# EAGLE design BMS ERROR Detection (EAGLE 8.4.1)
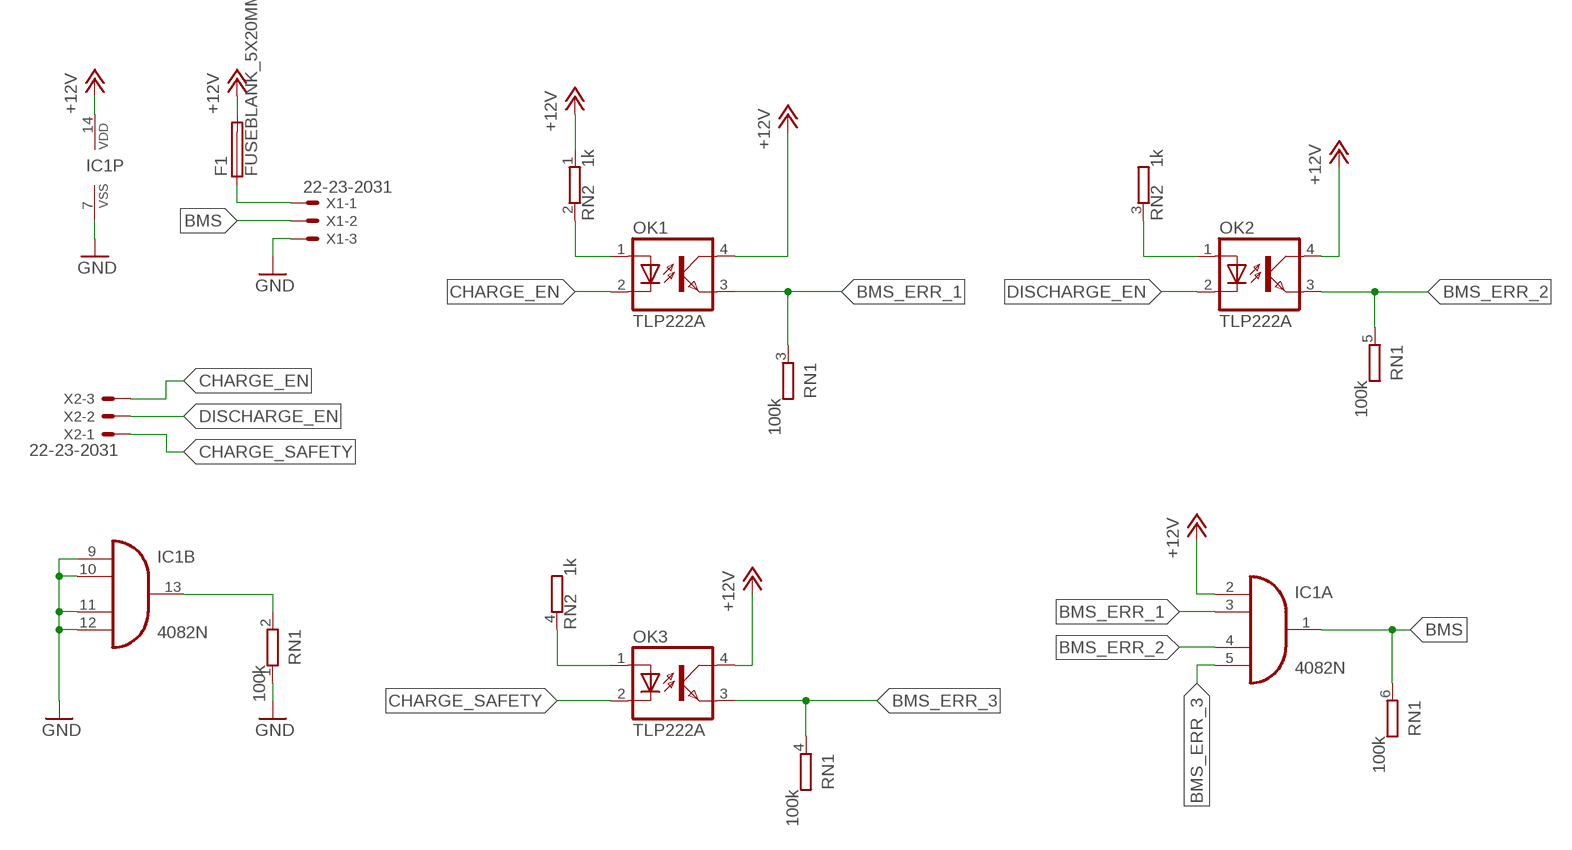
[diagram p0: schematic, sheet 1]

## Parts
F1  FUSEBLANK_5X20MM  [FUSE_HOLDER_5X20MM]
IC1  4082N  [DIL14]
OK1  TLP222A  LTV816  [DIL04]
OK2  TLP222A  LTV816  [DIL04]
OK3  TLP222A  LTV816  [DIL04]
RN1  100k  GE05RP  [SIL6]
RN2  1k  GE03RP  [SIL4]
X1  22-23-2031  [22-23-2031]
X2  22-23-2031  [22-23-2031]

## Nets
+12V: F1.2 IC1.2(A:I0) IC1.14(P:VDD) OK1.4(COL) OK2.4(COL) OK3.4(COL) RN2.1
BMS: IC1.1(A:O) RN1.6 X1.2
BMS_ERR_1: IC1.3(A:I1) OK1.3(EMIT) RN1.3
BMS_ERR_2: IC1.4(A:I2) OK2.3(EMIT) RN1.5
BMS_ERR_3: IC1.5(A:I3) OK3.3(EMIT) RN1.4
CHARGE_EN: OK1.2(C) X2.3
CHARGE_SAFETY: OK3.2(C) X2.1
DISCHARGE_EN: OK2.2(C) X2.2
GND: IC1.7(P:VSS) IC1.9(B:I0) IC1.10(B:I1) IC1.11(B:I2) IC1.12(B:I3) RN1.1 X1.3
N$1: IC1.13(B:O) RN1.2
N$2: OK1.1(A) RN2.2
N$3: OK2.1(A) RN2.3
N$4: OK3.1(A) RN2.4
N$5: F1.1 X1.1

## Library data of the parts
F1 = fuse:FUSE: Fuse; OC_FARNELL: unknown; OC_NEWARK: unknown
IC1 = 40xx:4082: Dual 4-input AND
OK1-OK3 = optocoupler:LTV816: OPTO COUPLER Source: LITEON, LTV816.pdf; OC_FARNELL: unknown; OC_NEWARK: unknown
RN1 = resistor-sil:GE05RP: SIL RESISTOR; OC_FARNELL: unknown; OC_NEWARK: unknown
RN2 = resistor-sil:GE03RP: SIL RESISTOR; OC_FARNELL: unknown; OC_NEWARK: unknown
X1 X2 = con-molex:22-23-2031: .100" (2.54mm) Center Header - 3 Pin; MF: MOLEX; MPN: 22-23-2031; OC_FARNELL: 1462950; OC_NEWARK: 30C0862

## Board
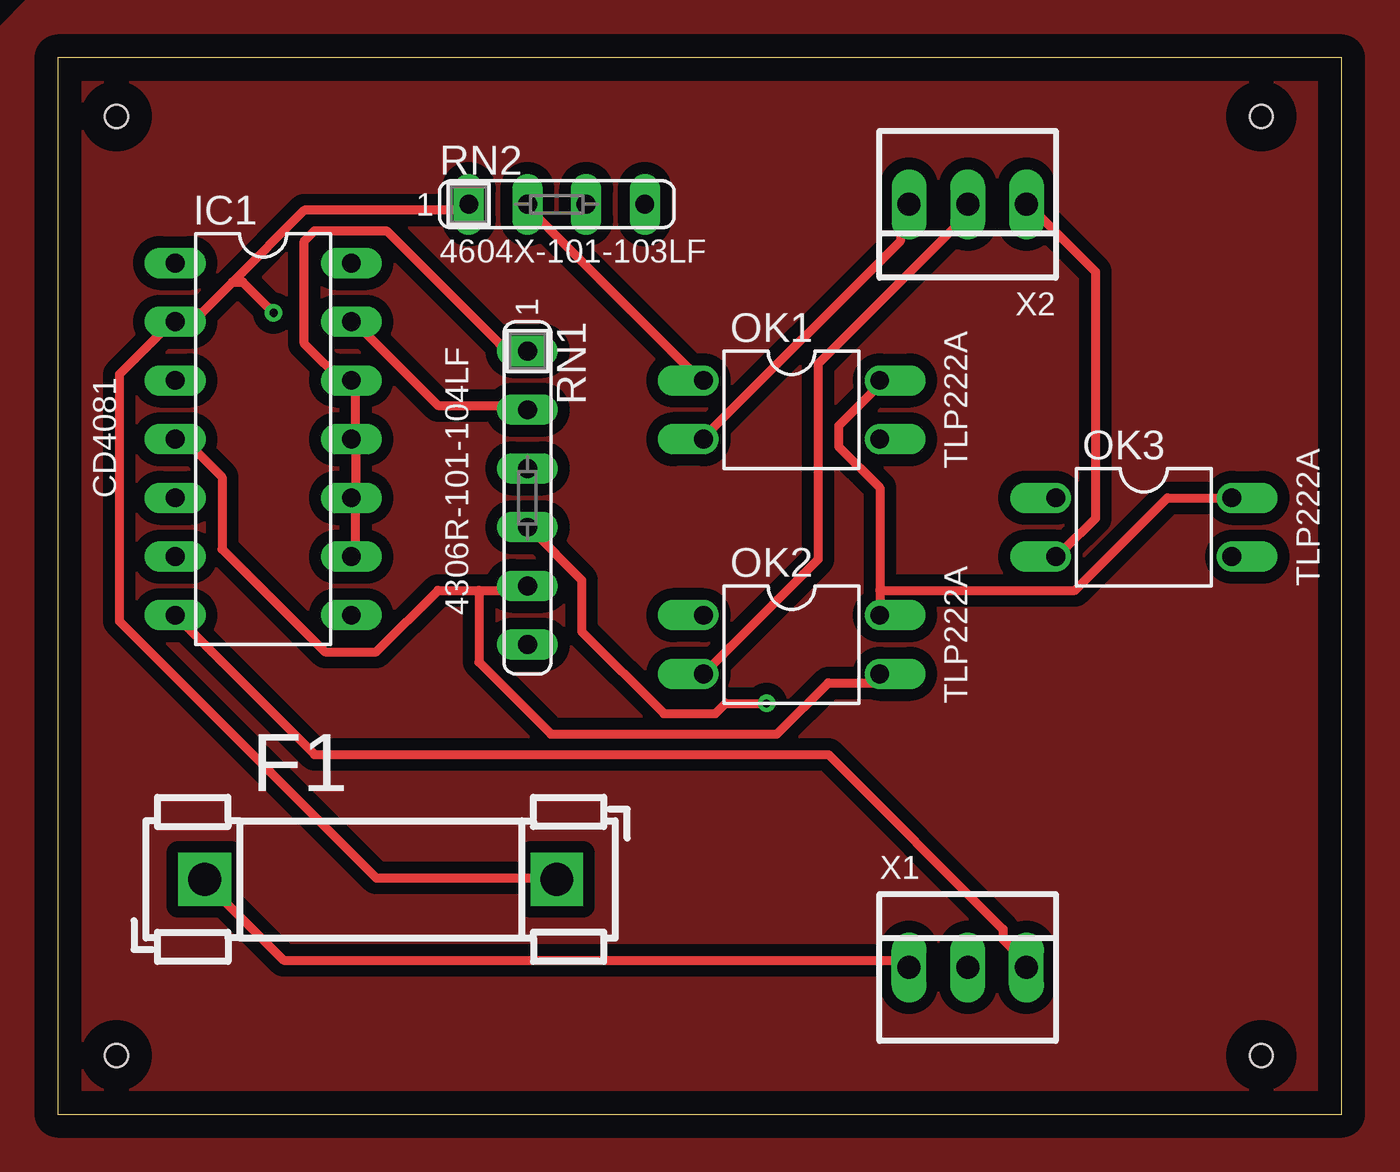
[diagram p1: board, top side]
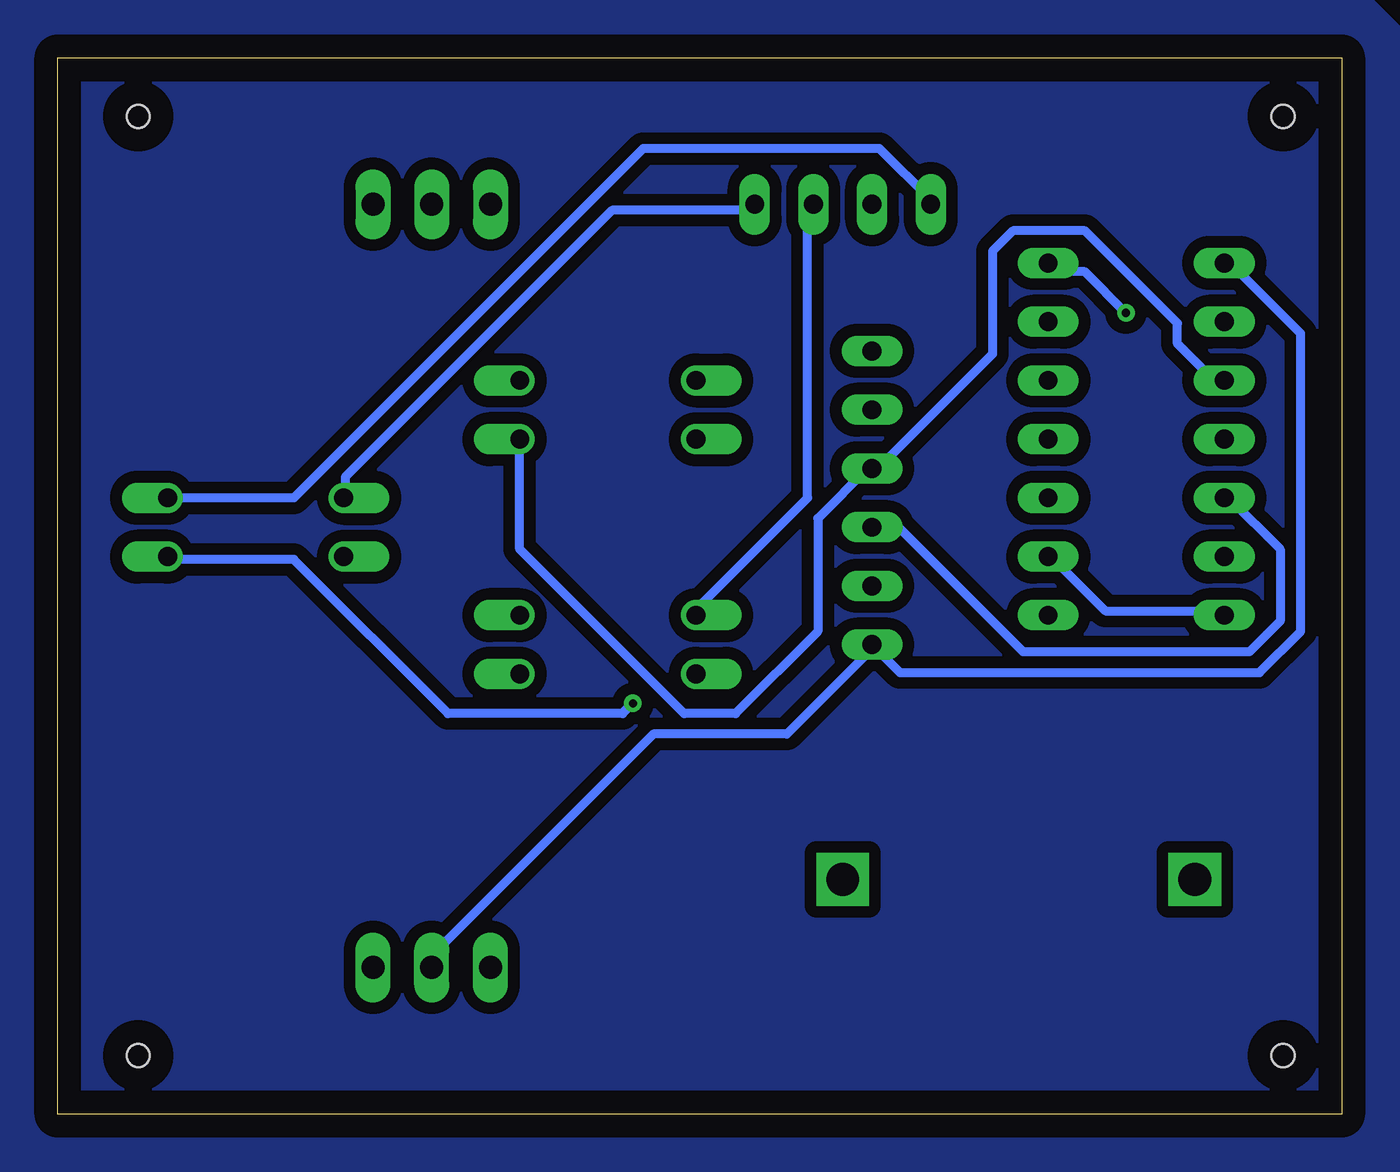
[diagram p2: board, bottom side, seen from below]

Size 55.55 x 45.71 mm. Coordinates in mm from the lower left corner, seen from the top.
Outline: 0,0 55.55,0 55.55,45.71 0,45.71 0,0
Copper layers (1*16): Top 0.035mm / dielectric 1.5mm / Bottom 0.035mm
Design rules "default *": minimum track width 15mil, minimum drill 0.35mm, track to track 20mil, track to pad 20mil, pad to pad 20mil, via to via 20mil, smd to smd 6mil, copper to edge 40mil, drill to drill 6mil, minimum pad ring 10mil, minimum via ring 8mil, stop-mask expansion 4mil, vias tented up to drill 0mil, thermal gap 10mil
Holes 1 mm at 2.54,43.18 2.54,2.54 52.07,2.54 52.07,43.18

### Footprints (pad centres in the part's own frame; a part is rotated, then mirrored left to right if it is on the bottom)
FUSE_HOLDER_5X20MM = drill 1.422 pad 2.286 square: 1 0,0; 2 15.24,0
DIL14 = drill 0.813 long: 1 -7.62,-3.81; 2 -5.08,-3.81; 3 -2.54,-3.81; 4 0,-3.81; 5 2.54,-3.81; 6 5.08,-3.81; 7 7.62,-3.81; 8 7.62,3.81; 9 5.08,3.81; 10 2.54,3.81; 11 0,3.81; 12 -2.54,3.81; 13 -5.08,3.81; 14 -7.62,3.81
DIL04 = drill 0.813 offset: 1 -1.27,-3.81; 2 1.27,-3.81; 3 1.27,3.81; 4 -1.27,3.81
SIL6 = drill 0.813 long: 1 -6.35,0; 2 -3.81,0; 3 -1.27,0; 4 1.27,0; 5 3.81,0; 6 6.35,0
SIL4 = drill 0.813 long: 1 -3.81,0; 2 -1.27,0; 3 1.27,0; 4 3.81,0
22-23-2031 = drill 1 long: 1 -2.54,0; 2 0,0; 3 2.54,0

### Placement (x,y rotation side)
F1  6.35,10.16 0 top
IC1  8.89,29.21 270 top
OK1  31.75,30.48 270 top
OK2  31.75,20.32 270 top
OK3  46.99,25.4 270 top
RN1  20.32,26.67 270 top
RN2  21.59,39.37 0 top
X1  39.37,6.35 0 top
X2  39.37,39.37 180 top

### Tracks (layer width: path | path; a pad name or v marks a point on that pad's centre or on a via)
+12V  (via drill 0.35)
  Top 0.381: 35.56,22.67 35.56,27.11 33.78,28.89 33.78,29.78 35.56,31.56 OK1.4 | 35.56,22.67 OK2.4 | OK3.4 48.01,26.67 44.01,22.67 35.56,22.67 | 7.56,36.01 10.67,39.12 17.78,39.12 RN2.1 | 7.56,36.01 6.22,34.67 5.33,34.67 IC1.2 4.89,34.23 2.67,32 2.67,21.34 13.78,10.22 21.34,10.22 F1.2 | v9.34,34.67 8,36.01 7.56,36.01
  Bottom 0.381: v9.34,34.67 11.11,36.45 12.45,36.45 IC1.14 | OK3.4 45.34,26.67 30.23,41.78 20,41.78 17.78,39.56 RN2.1
BMS
  Bottom 0.381: IC1.1 4.89,36.45 4.45,36.45 1.78,33.78 1.78,20.89 3.56,19.11 19.11,19.11 RN1.6 20.45,20 24,16.45 29.78,16.45 39.12,7.11 39.12,6.67 X1.2
BMS_ERR_1
  Bottom 0.381: IC1.3 5.33,31.56 7.11,33.34 7.11,34.23 11.11,38.23 14.22,38.23 15.11,37.34 15.11,32.89 20,28 RN1.3 20.45,28 22.67,25.78 22.67,20.89 26.23,17.34 28.45,17.34 35.56,24.45 OK1.3
BMS_ERR_2
  Top 0.381: 18.22,22.67 16.45,22.67 13.78,20 11.56,20 7.11,24.45 7.11,27.56 5.33,29.34 IC1.4 | 18.22,22.67 20,22.67 RN1.5 | 18.22,22.67 18.22,19.56 21.34,16.45 31.11,16.45 33.34,18.67 35.56,18.67 OK2.3
BMS_ERR_3  (via drill 0.35)
  Top 0.381: v30.67,17.78 28.89,17.78 28.45,17.34 26.23,17.34 22.67,20.89 22.67,23.11 20.45,25.34 RN1.4
  Bottom 0.381: RN1.4 20,25.34 19.11,25.34 13.78,20 4,20 2.67,21.34 2.67,24.45 4.89,26.67 IC1.5 | v30.67,17.78 31.11,17.34 38.67,17.34 45.34,24 50.67,24 OK3.3
CHARGE_EN
  Top 0.381: OK1.2 28,29.34 36.45,37.78 36.45,39.12 X2.3
CHARGE_SAFETY
  Top 0.381: OK3.2 43.56,24.45 44.9,25.78 44.9,36.45 42.23,39.12 X2.1
DISCHARGE_EN
  Top 0.381: OK2.2 32.89,24 32.89,32.45 39.56,39.12 X2.2
GND
  Top 0.381: 12.89,26.67 12.89,28.89 IC1.11 12.89,29.34 12.89,31.56 IC1.12 12.45,31.56 10.67,33.34 10.67,37.78 11.11,38.23 14.22,38.23 19.11,33.34 20,33.34 RN1.1 | IC1.7 11.11,15.56 33.34,15.56 40.89,8 40.89,7.56 41.78,6.67 X1.3 | 12.89,26.67 12.89,24.45 IC1.9 | 12.89,26.67 IC1.10
  Bottom 0.381: IC1.7 5.33,21.78 10.22,21.78 12.45,24 IC1.9
N$1
  Top 0.381: RN1.2 20,30.67 16.45,30.67 12.89,34.23 IC1.13
N$2
  Top 0.381: RN2.2 20.45,39.12 27.56,32 OK1.1
N$3
  Bottom 0.381: RN2.3 23.11,39.12 23.11,26.67 28,21.78 OK2.1
N$4
  Bottom 0.381: OK3.1 43.12,26.67 43.12,27.56 31.56,39.12 25.78,39.12 RN2.4
N$5
  Top 0.381: X1.1 36.45,6.67 9.78,6.67 6.67,9.78 F1.1
N$6
  pour Top: -2.54,46.99 -2.54,-2.54 59.69,-2.54 59.69,48.26 -1.27,48.26
N$7
  pour Bottom: -1.27,48.26 -2.54,46.99 -2.54,45.72 -2.54,-2.54 59.69,-2.54 59.69,48.26

### Text on the board
tNames: 4604X-101-103LF | TLP222A | CD4081 | TLP222A | 4306R-101-104LF | TLP222A